# EAGLE design water_level_sc (EAGLE 9.6.2)
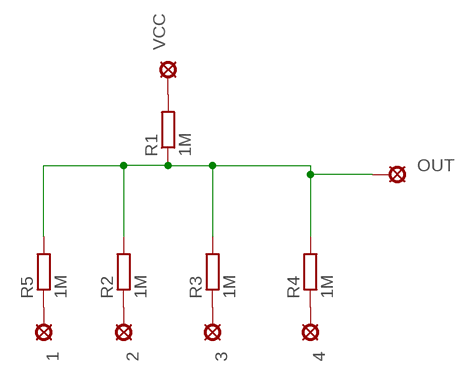
[diagram p0: schematic, sheet 1]

## Parts
1  SE13  [SE13]
2  SE13  [SE13]
3  SE13  [SE13]
4  SE13  [SE13]
OUT  SE13  [SE13]
R1  1M  R-EU_R0805  [R0805]
R2  1M  R-EU_R0805  [R0805]
R3  1M  R-EU_R0805  [R0805]
R4  1M  R-EU_R0805  [R0805]
R5  1M  R-EU_R0805  [R0805]
VCC  SE13  [SE13]

## Nets
N$1: 4.MP R4.1
N$2: 3.MP R3.1
N$3: 2.MP R2.1
N$4: 1.MP R5.1
N$5: R1.2 VCC.MP
N$8: OUT.MP R1.1 R2.2 R3.2 R4.2 R5.2

## Library data of the parts
1-4 OUT VCC = solpad:SE13: SOLDER PAD E1542, drill 1,3mm, distributor Buerklin, 07F815
R1-R5 = rcl:R-EU_: RESISTOR, European symbol; SPICEPREFIX: R

## Board
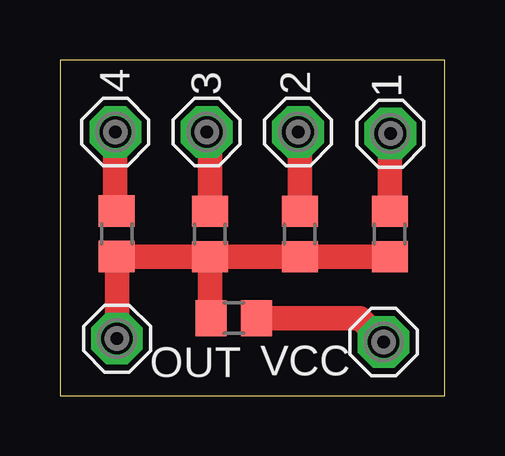
[diagram p1: board, top side]

Size 16.05 x 13.99 mm. Coordinates in mm from the lower left corner, seen from the top.
Outline: 0,0 16.05,0 16.05,13.99 0,13.99 0,0
Copper layers (1*16): Top 0.035559375mm / dielectric 1.6mm / Bottom 0.035559375mm
Design rules "jlcpcb2layer": minimum track width 5mil, minimum drill 12mil, track to track 5mil, track to pad 5mil, pad to pad 5mil, via to via 5mil, smd to smd 5mil, copper to edge 8mil, drill to drill 6mil, minimum pad ring 5mil, minimum via ring 3mil, stop-mask expansion 2.5mil, vias tented up to drill 0mil, thermal gap 10mil

### Footprints (pad centres in the part's own frame; a part is rotated, then mirrored left to right if it is on the bottom)
SE13 = drill 1.321 pad 2.159 octagon: MP 0,0
R0805 = smd 1.3 x 1.5: 1 -0.95,0; 2 0.95,0

### Placement (x,y rotation side)
1  13.78,10.93 0 top
2  9.93,10.99 0 top
3  6.12,10.99 0 top
4  2.31,10.99 0 top
OUT  2.38,2.38 0 top
R1  7.25,3.24 0 top
R2  10,6.74 270 top
R3  6.25,6.74 270 top
R4  2.37,6.75 270 top
R5  13.75,6.74 270 top
VCC  13.5,2.24 0 top

### Tracks (layer width: path | path; a pad name or v marks a point on that pad's centre or on a via)
N$1
  Top 1.016: 4.MP 2.31,7.7 R4.1
N$2
  Top 1.016: R3.1 6.25,10.86 3.MP
N$3
  Top 1.016: R2.1 10,10.92 2.MP
N$4
  Top 1.016: R5.1 13.75,10.89 1.MP
N$5
  Top 1.016: VCC.MP 12.5,3.24 R1.2
N$8
  Top 1.016: R1.1 6.25,3.29 R3.2 | R3.2 R2.2 R5.2 | OUT.MP R4.2 R3.2